# EAGLE design lan (EAGLE 9.6.2)
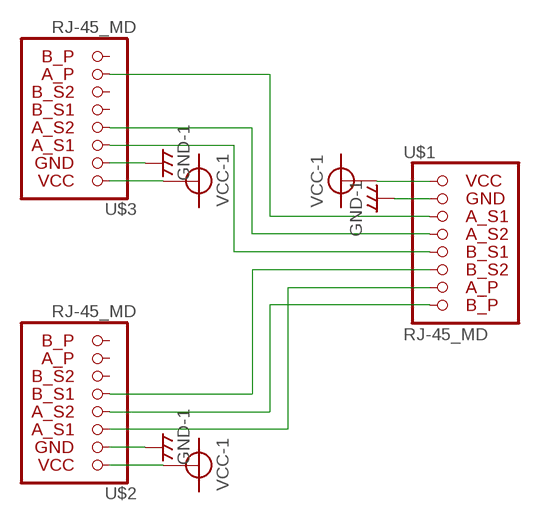
[diagram p0: schematic, sheet 1]

## Parts
U$1  RJ-45_MD  [996-A2-1188A2]
U$2  RJ-45_MD  [996-A2-1188A2]
U$3  RJ-45_MD  [996-A2-1188A2]

## Nets
GND: U$1.2 U$2.2 U$3.2 ; supply symbol labelled GND-1
N$1: U$1.3 U$3.7
N$2: U$1.4 U$3.4
N$3: U$1.5 U$3.3
N$4: U$1.8 U$2.4
N$5: U$1.6 U$2.5
N$6: U$1.7 U$2.3
VCC-1: U$1.1 U$2.1 U$3.1
Unconnected: U$2.6 U$2.7 U$2.8 U$3.5 U$3.6 U$3.8

## Library data of the parts
U$1-U$3 = Robocon-Connector:RJ-45_MD

## Board
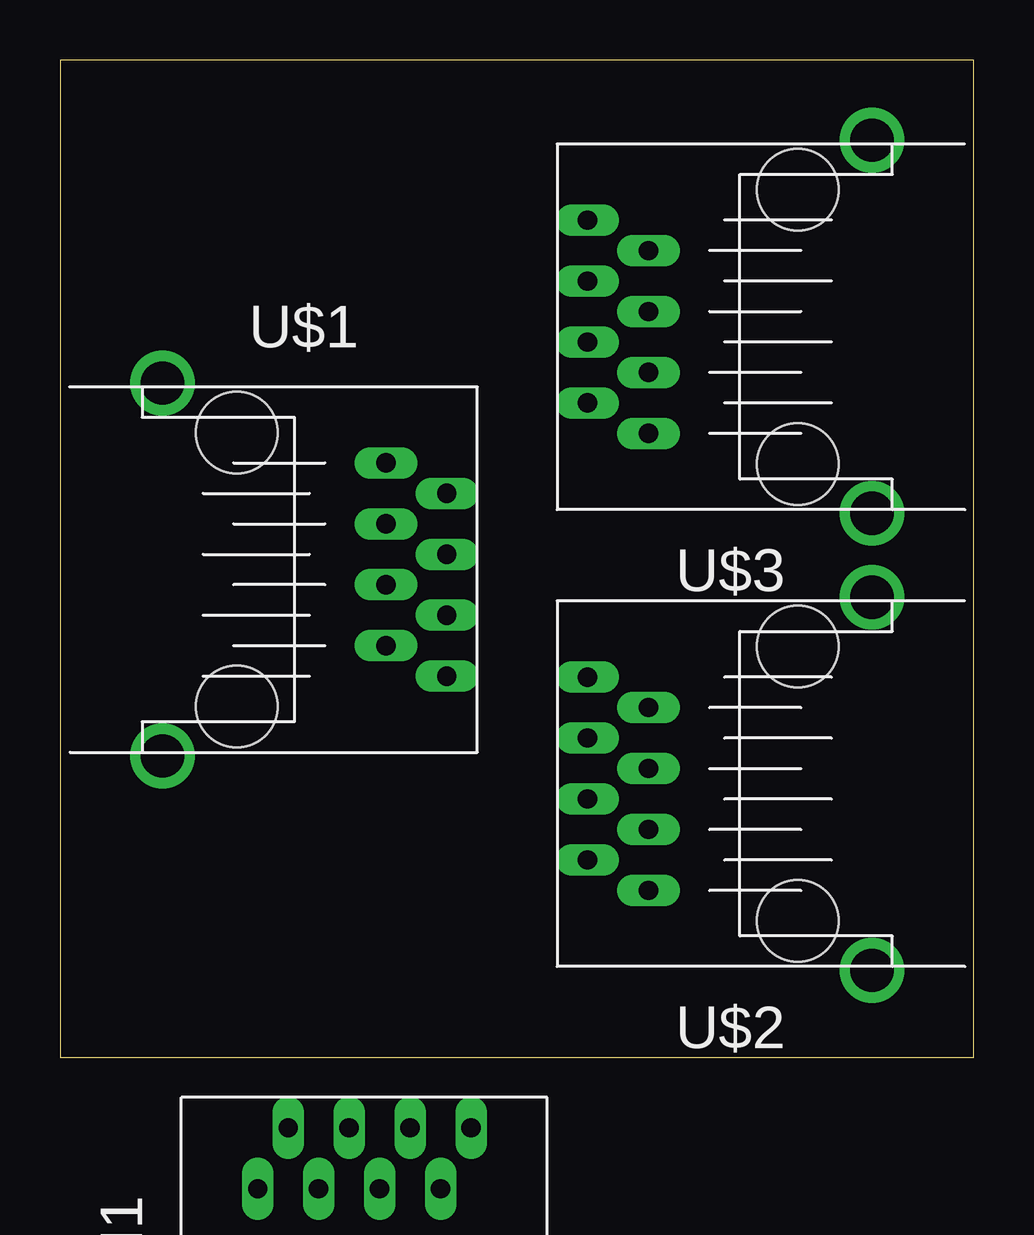
[diagram p1: board, top side]
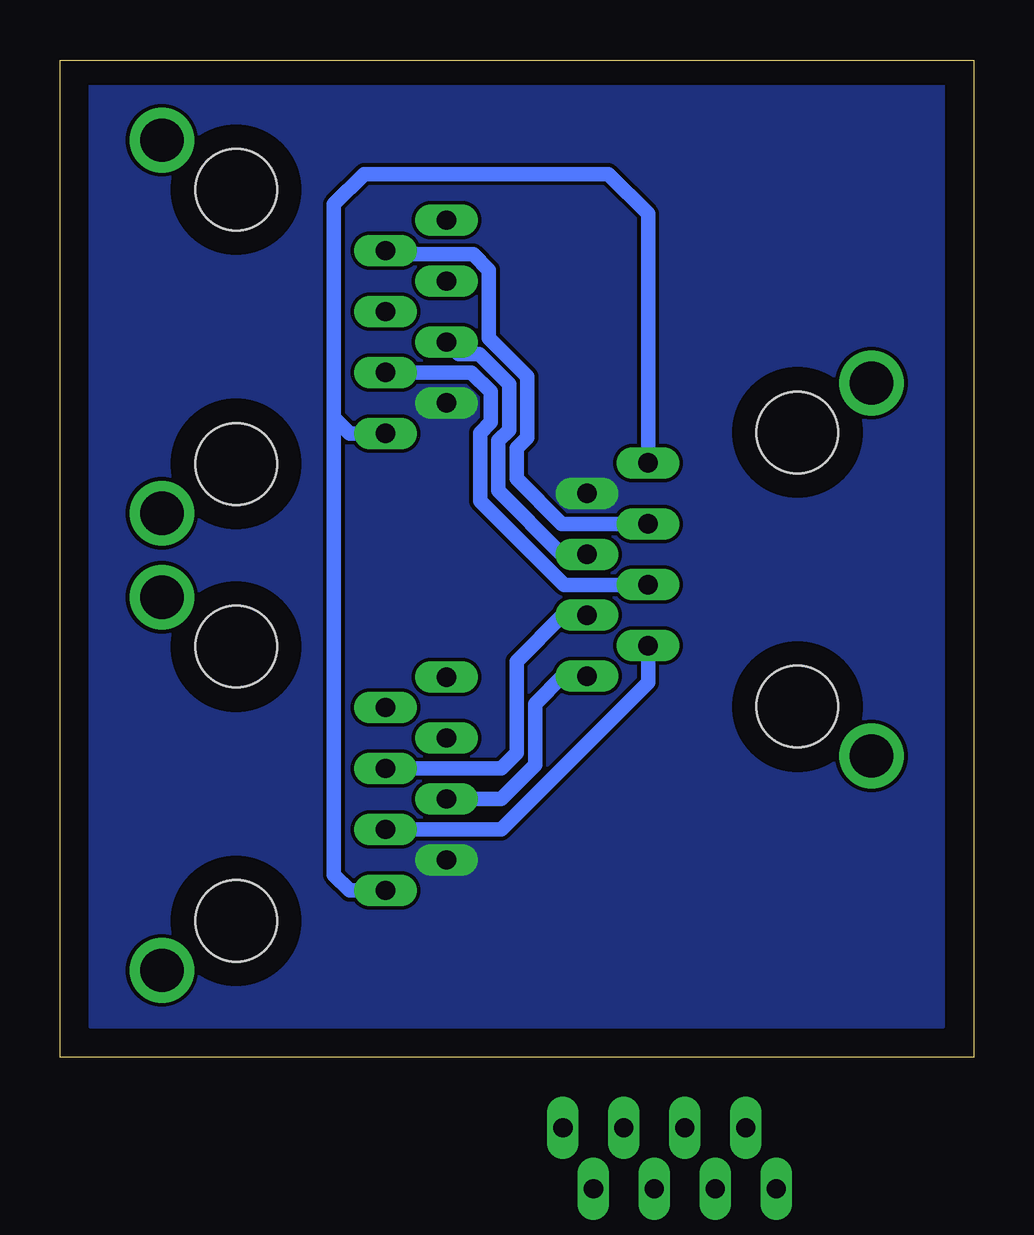
[diagram p2: board, bottom side, seen from below]

Size 38.08 x 41.58 mm. Coordinates in mm from the lower left corner, seen from the top.
Outline: 0,0 38.08,0 38.08,41.58 0,41.58 0,0
Copper layers (1*16): Top 0.035mm / dielectric 1.5mm / Bottom 0.035mm
Design rules "default": minimum track width 6mil, minimum drill 0.35mm, track to track 6mil, track to pad 6mil, pad to pad 6mil, via to via 6mil, smd to smd 6mil, copper to edge 40mil, drill to drill 6mil, minimum pad ring 10mil, minimum via ring 8mil, stop-mask expansion 4mil, vias tented up to drill 0mil, thermal gap 10mil

### Footprints (pad centres in the part's own frame; a part is rotated, then mirrored left to right if it is on the bottom)
996-A2-1188A2 = drill 0.8 long: 1 -4.465,4.69; 2 -3.195,7.23; 3 -1.925,4.69; 4 -0.655,7.23; 5 0.615,4.69; 6 1.885,7.23; 7 3.155,4.69; 8 4.425,7.23 | drill 1.8: P$1 -7.795,-4.623; P$2 7.755,-4.623 | hole 3.4: -5.735,-1.533; 5.695,-1.533

### Placement (x,y rotation side)
LAN1  996-A2-1188A2  [996-A2-1188A2]  12.7,-10.16 0 top
U$1  8.89,20.32 270 top
U$2  29.21,11.43 90 top
U$3  29.21,30.48 90 top

### Tracks (layer width: path | path; a pad name or v marks a point on that pad's centre or on a via)
GND
  pour Bottom (no thermals): 1.27,1.27 36.83,1.27 36.83,40.64 1.27,40.64
N$1
  Bottom 0.61: U$1.3 17.16,22.25 19.05,24.13 19.05,25.4 18.6,25.85 18.6,28.38 20.21,29.99 20.21,32.83 20.87,33.48 24.36,33.48 U$3.7
N$2
  Bottom 0.61: U$3.4 21.47,29.32 20.62,29.32 19.37,28.06 19.37,26.16 19.81,25.72 19.81,23.62 17.16,20.98 U$1.4
N$3
  Bottom 0.61: U$1.5 17.07,19.7 20.57,23.2 20.57,26.03 20.13,26.48 20.13,27.75 20.93,28.55 U$3.3
N$4
  Bottom 0.61: U$1.8 17.12,15.89 18.29,14.73 18.29,12.19 19.7,10.78 U$2.4
N$5
  Bottom 0.61: U$1.6 17.12,18.43 19.05,16.51 19.05,12.7 19.7,12.04 U$2.5
N$6
  Bottom 0.61: U$1.7 13.58,15.63 19.7,9.51 U$2.3
VCC-1
  Bottom 0.61: U$1.1 13.58,35.17 15.24,36.83 25.4,36.83 26.67,35.56 26.67,26.67 | 26.67,26.67 26.67,7.62 26.02,6.96 U$2.1 | U$3.1 26.02,26.02 26.67,26.67